# EAGLE design centerbody_logic (EAGLE 9.4.2)
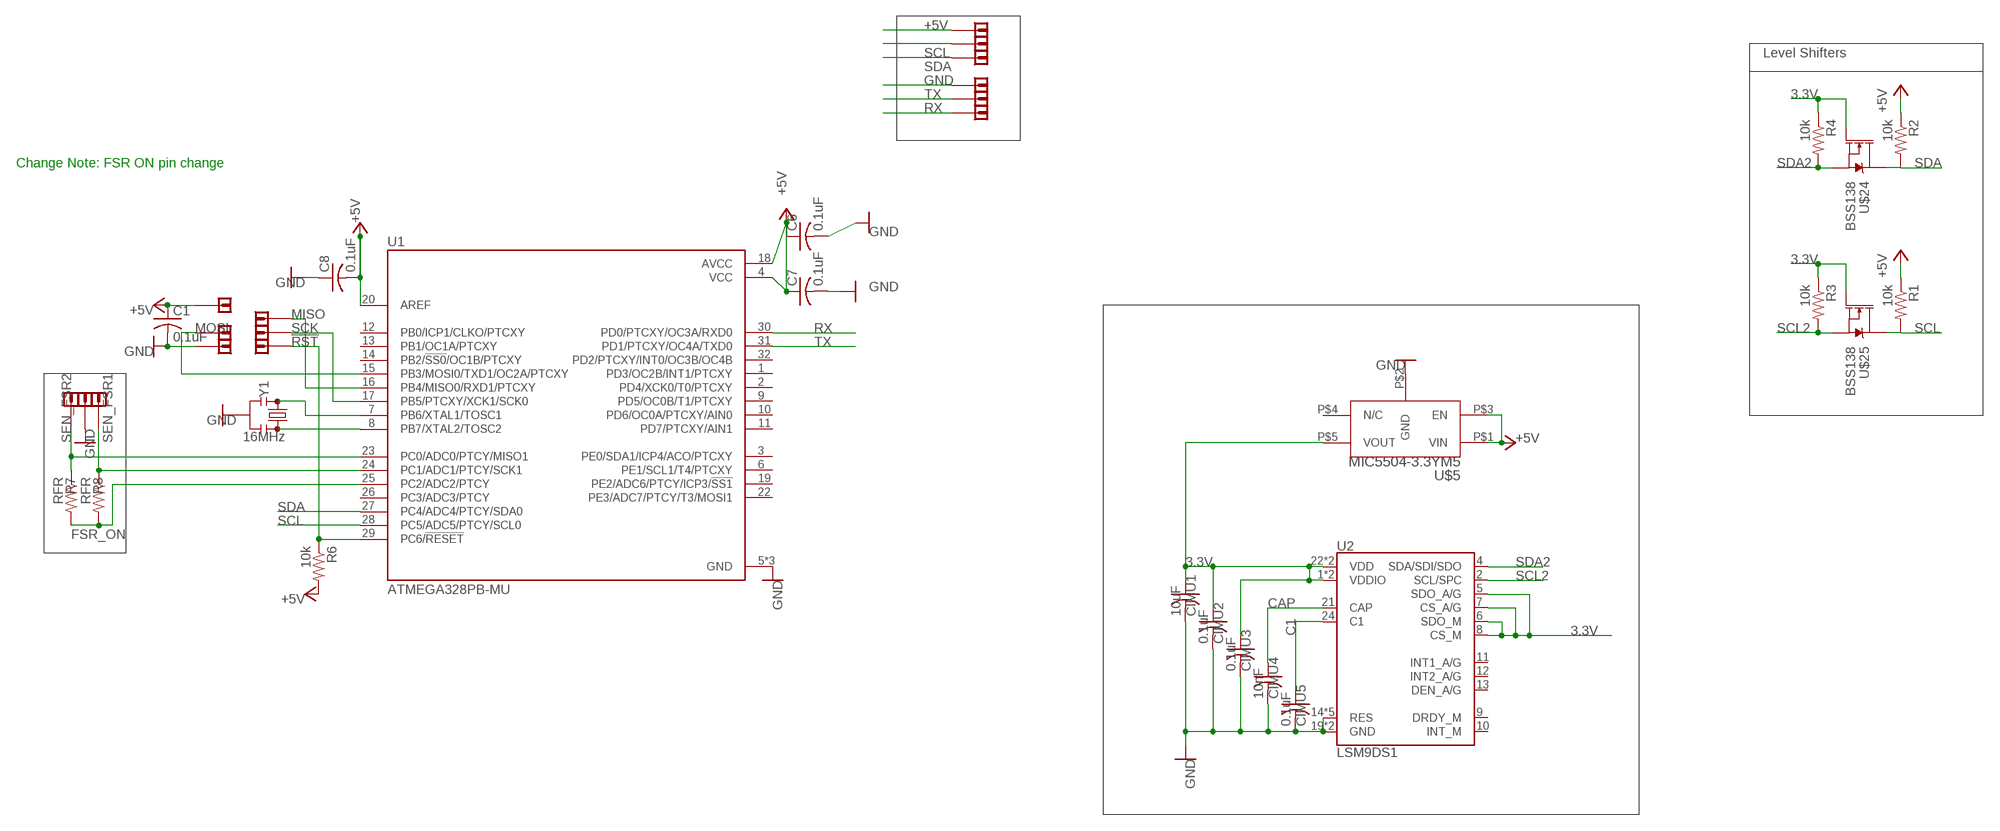
[diagram p0: schematic, sheet 1]

## Parts
C1  0.1uF  C-USC0402  [C0402]
C6  0.1uF  C-USC0402  [C0402]
C7  0.1uF  C-USC0402  [C0402]
C8  0.1uF  C-USC0402  [C0402]
CIMU1  10uF  C-USC0402  [C0402]
CIMU2  0.1uF  C-USC0402  [C0402]
CIMU3  0.1uF  C-USC0402  [C0402]
CIMU4  10nF  C-USC0402  [C0402]
CIMU5  0.1uF  C-USC0402  [C0402]
R1  10k  R-US_R0402  [R0402]
R2  10k  R-US_R0402  [R0402]
R3  10k  R-US_R0402  [R0402]
R4  10k  R-US_R0402  [R0402]
R6  10k  R-US_R0402  [R0402]
R7  RFR  R-US_R0402  [R0402]
R8  RFR  R-US_R0402  [R0402]
U1  ATMEGA328PB-MU  [QFN50P500X500X90-33N]
U2  LSM9DS1  [LGA24-8X4]
U$1  SIMPLE_VIA_CONNECTION  [SIMPLEVIA]
U$3  SIMPLE_VIA_CONNECTION  [SIMPLEVIA]
U$4  SIMPLE_VIA_CONNECTION  [SIMPLEVIA]
U$5  MIC5504-3.3YM5  [SOT23]
U$6  SIMPLE_VIA_CONNECTION  [SIMPLEVIA]
U$7  SIMPLE_VIA_CONNECTION  [SIMPLEVIA]
U$8  SIMPLE_VIA_CONNECTION  [SIMPLEVIA]
U$9  SIMPLE_VIA_CONNECTION  [SIMPLEVIA]
U$10  SIMPLE_VIA_CONNECTION  [SIMPLEVIA]
U$11  SIMPLE_VIA_CONNECTION  [SIMPLEVIA]
U$12  SIMPLE_VIA_CONNECTION  [SIMPLEVIA]
U$13  SIMPLE_VIA_CONNECTION  [SIMPLEVIA]
U$14  SIMPLE_VIA_CONNECTION  [SIMPLEVIA]
U$15  SIMPLE_VIA_CONNECTION  [SIMPLEVIA]
U$24  BSS138  [SOT-23]
U$25  BSS138  [SOT-23]
U$26  SIMPLE_VIA_CONNECTION  [SIMPLEVIA]
U$27  SIMPLE_VIA_CONNECTION  [SIMPLEVIA]
Y1  16MHz  RESONATOR-16MHZSMD_3.2X1.3  [RESONATOR-SMD-3.2X1.3]

## Nets
3.3V [power]: CIMU1.1 CIMU2.1 CIMU3.1 R3.1 R4.1 U2.1(VDDIO) U2.3(VDDIO) U2.5(SDO_A/G) U2.6(SDO_M) U2.7(CS_A/G) U2.8(CS_M) U2.22(VDD) U2.23(VDD) U$5.P$5(VOUT) U$24.P$1(G) U$25.P$1(G)
!RST [digital signals]: R6.1 U1.29(PC6/!RESET!) U$13.P$1
+5V [power]: C1.1 C6.1 C7.1 C8.2 R1.1 R2.1 R6.2 U1.4(VCC) U1.18(AVCC) U1.20(AREF) U$5.P$1(VIN) U$5.P$3(EN) U$7.P$1 U$10.P$1
C1 [analog signals]: CIMU5.1 U2.24(C1)
CAP [analog signals]: CIMU4.1 U2.21(CAP)
FSR_ON [digital signals]: R7.2 R8.2 U1.25(PC2/ADC2/PTCY)
GND [power]: C1.2 C6.2 C7.2 C8.1 CIMU1.2 CIMU2.2 CIMU3.2 CIMU4.2 CIMU5.2 U1.5(GND) U1.21(GND) U1.33(GND) U2.14(RES) U2.15(RES) U2.16(RES) U2.17(RES) U2.18(RES) U2.19(GND) U2.20(GND) U$3.P$1 U$5.P$2(GND) U$6.P$1 U$12.P$1 Y1.2
MISO [digital signals]: U1.16(PB4/MISO0/RXD1/PTCXY) U$15.P$1
MOSI [digital signals]: U1.15(PB3/MOSI0/TXD1/OC2A/PTCXY) U$11.P$1
N$1 [analog signals]: U1.8(PB7/XTAL2/TOSC2) Y1.3
N$2 [analog signals]: U1.7(PB6/XTAL1/TOSC1) Y1.1
RX [digital signals]: U1.30(PD0/PTCXY/OC3A/RXD0) U$27.P$1
SCK [digital signals]: U1.17(PB5/PTCXY/XCK1/SCK0) U$14.P$1
SCL [digital signals]: R1.2 U1.28(PC5/ADC5/PTCY/SCL0) U$9.P$1 U$25.P$3(D)
SCL2 [digital signals]: R3.2 U2.2(SCL/SPC) U$25.P$2(S)
SDA [digital signals]: R2.2 U1.27(PC4/ADC4/PTCY/SDA0) U$4.P$1 U$24.P$3(D)
SDA2 [digital signals]: R4.2 U2.4(SDA/SDI/SDO) U$24.P$2(S)
SEN_FSR1 [analog signals]: R8.1 U1.24(PC1/ADC1/PTCY/SCK1) U$8.P$1
SEN_FSR2 [analog signals]: R7.1 U1.23(PC0/ADC0/PTCY/MISO1) U$1.P$1
TX [digital signals]: U1.31(PD1/PTCXY/OC4A/TXD0) U$26.P$1
Unconnected: U1.1(PD3/OC2B/INT1/PTCXY) U1.2(PD4/XCK0/T0/PTCXY) U1.3(PE0/SDA1/ICP4/ACO/PTCXY) U1.6(PE1/SCL1/T4/PTCXY) U1.9(PD5/OC0B/T1/PTCXY) U1.10(PD6/OC0A/PTCXY/AIN0) U1.11(PD7/PTCXY/AIN1) U1.12(PB0/ICP1/CLKO/PTCXY) U1.13(PB1/OC1A/PTCXY) U1.14(PB2/!SS0!/OC1B/PTCXY) U1.19(PE2/ADC6/PTCY/ICP3/!SS1!) U1.22(PE3/ADC7/PTCY/T3/MOSI1) U1.26(PC3/ADC3/PTCY) U1.32(PD2/PTCXY/INT0/OC3B/OC4B) U2.9(DRDY_M) U2.10(INT_M) U2.11(INT1_A/G) U2.12(INT2_A/G) U2.13(DEN_A/G) U$5.P$4(N/C)

## Notes on the sheet
- Level Shifters
- Change Note: FSR ON pin change

## Library data of the parts
C1 C6-C8 CIMU2 CIMU3 CIMU5 = FA3D_lib:C-US: CAPACITOR, American symbol; PARTNO: 885012105010
CIMU1 = FA3D_lib:C-US: CAPACITOR, American symbol; PARTNO: GRM155R60G106ME44D
CIMU4 = FA3D_lib:C-US: CAPACITOR, American symbol; PARTNO: CL05B103KB5NNNC
R1-R4 R6 = FA3D_lib:R-US_: RESISTOR, American symbol; PARTNO: RR0510P-103-D
R7 R8 = FA3D_lib:R-US_: RESISTOR, American symbol; PARTNO: CRGCQ0402F5K6
U1 = FA3D_lib:ATMEGA328PB-MU: AVR 32KBytes Flash, 1KBytes EEPROM, 2KBytes RAM, w - 20MHZ, QFN/MFL, IND TEMP, GREEN 5 V/ DFN/QFN (M); DESCRIPTION: AVR 32KBytes Flash, 1KBytes EEPROM, 2KBytes RAM, w - 20MHZ, QFN/MFL, IND TEMP, GREEN 5 V/ DFN/QFN _M_; DIGI-KEY_PART_NUMBER: ATMEGA328PB-MU-ND; DIGI-KEY_PURCHASE_URL: https://www.digikey.com/product-detail/en/microchip-technology/ATMEGA328PB-MU/ATMEGA328PB-MU-ND/5638814?utm_source=snapeda&utm_medium=aggregator&utm_campaign=symbol; MF: Microchip; MP: ATMEGA328PB-MU; PACKAGE: VFQFN-32 Microchip; PARTNO: ATMEGA328PB-MUR
U2 = FA3D_lib:LSM9DS1: LSM9DS1 3D accelerometer, gyroscope & magnetometer The LSM9DS1 is a system-in-package featuring a 3D digital linear acceleration sensor, a 3D digital angular rate sensor, and a 3D digital magnetic sensor. The LSM9DS1 has a linear acceleration full scale of ±2g/±4g/±8/±16 g, a magnetic field full scale of ±4/±8/±12/±16 gauss and an angular rate of ±245/±500/±2000 dps. The LSM9DS1 includes an I2 C serial bus interface supporting standard and fast mode (100 kHz and 400 kHz) and an SPI serial standard interface. Magnetic, accelerometer and gyroscope sensing can be enabled or set in power-down mode separately for smart power management. The LSM9DS1 is available in a plastic land grid array package (LGA) and it is guaranteed to operate over an extended temperature range from -40 °C to +85 °C.; PARTNO: LSM9DS1TR; PROD_ID: IC-12536
U$1 U$3 U$4 U$6-U$15 U$26 U$27 = FA3D_lib:SIMPLE_VIA_CONNECTION
U$5 = FA3D_lib:MIC5504-3.3YM5; PARTNO: MIC5504-3.3YM5-TR
U$24 U$25 = FA3D_lib:BSS138; PARTNO: BSS138
Y1 = SparkFun-Clocks:RESONATOR-16MHZ: 16MHz Resonator Digikey Example <http://www.digikey.com/product-detail/en/murata-electronics-north-america/CSTCE16M0V53-R0/490-1198-1-ND/584635> Frequency: 16MHz Frequency Stability: ±0.3% Frequency Tolerance: ±0.5% Capacitance: 15pF SparkFun Products SparkFun OpenLog <https://www.sparkfun.com/products/13712> SparkFun MicroView - OLED Arduino Module <https://www.sparkfun.com/products/12923>; PARTNO: CSTNE16M0V530000R0; PROD_ID: XTAL-08900

## Net classes
1 digital signals: width 0.15 mm, drill 0.3 mm, clearance 0.01 mm
2 analog signals: width 0.2 mm, drill 0.3 mm, clearance 0.015 mm
3 power: width 0.2 mm, drill 0.3 mm, clearance 0.015 mm

## Board
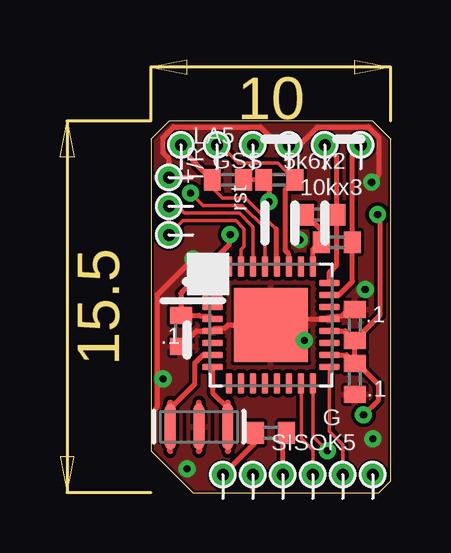
[diagram p1: board, top side]
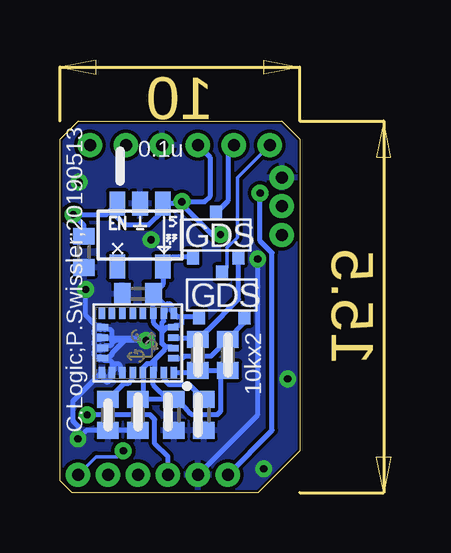
[diagram p2: board, bottom side, seen from below]

Size 10 x 15.5 mm. Coordinates in mm from the lower left corner, seen from the top.
Outline: 1.75,0 9.5,0 10,0.5 10,14.75 9.25,15.5 0.75,15.5 0,14.75 0,1.75 1.75,0
Copper layers (1*16): Top 0.035mm / dielectric 1.5mm / Bottom 0.035mm
Design rules "Swissler_Aggressive": minimum track width 0.1mm, minimum drill 0.3mm, track to track 0.15mm, track to pad 0.15mm, pad to pad 0.15mm, via to via 0.15mm, smd to smd 0.1mm, copper to edge 0.1mm, drill to drill 0.1mm, minimum pad ring 10mil, minimum via ring 8mil, stop-mask expansion 4mil, vias tented up to drill 25mil, thermal gap 0.125mm

### Footprints (pad centres in the part's own frame; a part is rotated, then mirrored left to right if it is on the bottom)
C0402 = smd 0.7 x 0.9: 1 -0.65,0; 2 0.65,0
R0402 = smd 0.7 x 0.9: 1 -0.65,0; 2 0.65,0
QFN50P500X500X90-33N = smd 0.86 x 0.26: 1 -2.435,1.75; 2 -2.435,1.25; 3 -2.435,0.75; 4 -2.435,0.25; 5 -2.435,-0.25; 6 -2.435,-0.75; 7 -2.435,-1.25; 8 -2.435,-1.75; 17 2.435,-1.75; 18 2.435,-1.25; 19 2.435,-0.75; 20 2.435,-0.25; 21 2.435,0.25; 22 2.435,0.75; 23 2.435,1.25; 24 2.435,1.75 | smd 0.26 x 0.86: 9 -1.75,-2.435; 10 -1.25,-2.435; 11 -0.75,-2.435; 12 -0.25,-2.435; 13 0.25,-2.435; 14 0.75,-2.435; 15 1.25,-2.435; 16 1.75,-2.435; 25 1.75,2.435; 26 1.25,2.435; 27 0.75,2.435; 28 0.25,2.435; 29 -0.25,2.435; 30 -0.75,2.435; 31 -1.25,2.435; 32 -1.75,2.435 | smd 3.1 x 3.1: 33 0,0
LGA24-8X4 = smd 0.27 x 0.45: 1 -1.505,1.225; 6 -1.505,-1.225; 7 -1.075,-1.225; 8 -0.645,-1.225; 9 -0.215,-1.225; 10 0.215,-1.225; 11 0.645,-1.225; 12 1.075,-1.225; 13 1.505,-1.225; 18 1.505,1.225; 19 1.075,1.225; 20 0.645,1.225; 21 0.215,1.225; 22 -0.215,1.225; 23 -0.645,1.225; 24 -1.075,1.225 | smd 0.45 x 0.27: 2 -1.475,0.645; 3 -1.475,0.215; 4 -1.475,-0.215; 5 -1.475,-0.645; 14 1.475,-0.645; 15 1.475,-0.215; 16 1.475,0.215; 17 1.475,0.645
SIMPLEVIA = drill 0.5: P$1 0,0
SOT23 = smd 0.66 x 1: P$1 0.95,1.315; P$2 0,1.315; P$3 -0.95,1.315; P$4 -0.95,-1.315; P$5 0.95,-1.315
SOT-23 = smd 0.5 x 0.6: P$1 -0.95,-0.925; P$2 0.95,-0.925; P$3 0,0.925
RESONATOR-SMD-3.2X1.3 = smd 0.45 x 1.905: 1 -1.2,0; 2 0,0; 3 1.2,0

### Placement (x,y rotation side)
C1  1.25,6.75 270 top
C6  8.5,4.75 270 top
C7  8.5,7 90 top
C8  9,10.05 90 bottom
CIMU1  5.25,3.25 270 bottom
CIMU2  6.75,3.25 270 bottom
CIMU3  6.75,8.3 180 bottom
CIMU4  8,3.25 270 bottom
CIMU5  4,3.25 270 bottom
R1  3.2,13.05 180 top
R2  5.35,13.05 0 top
R3  3,5.75 90 bottom
R4  4.25,5.75 90 bottom
R6  5,2.5 0 top
R7  7.75,10.45 180 top
R8  7.1,11.6 180 top
U1  5,7 0 top
U2  6.75,6.25 180 bottom
U$1  8.75,14.5 0 top
U$3  0.75,13.15 90 top
U$4  2.75,14.5 0 top
U$5  6.66,10.75 0 bottom
U$6  5.75,14.5 0 top
U$7  4.25,14.5 0 top
U$8  7.25,14.5 0 top
U$9  1.25,14.5 0 top
U$10  5.5,0.75 0 top
U$11  6.75,0.75 0 top
U$12  4.25,0.75 0 top
U$13  3,0.75 0 top
U$14  8,0.75 0 top
U$15  9.25,0.75 0 top
U$24  3.5,10.75 0 bottom
U$25  3.25,8.25 0 bottom
U$26  0.75,10.75 90 top
U$27  0.75,11.95 90 top
Y1  2,2.75 0 top

### Tracks (layer width: path | path; a pad name or v marks a point on that pad's centre or on a via)
3.3V
  Bottom 0.2: CIMU1.1 5.5,3.9 6.11,4.5 U2.23 6.06,5.07 6.06,5.53 | U2.1 4.33,5.03 R4.1 R3.1 3.3,4.8 3.3,3.4 3.45,3.25 4.5,3.25 4.55,3.3 4.7,3.45 5.15,3.9 CIMU1.1 | CIMU3.1 5.71,8.69 U$5.P$5 5.32,9.82 U$24.P$1 | U2.7 5.58,7.57 5.58,7.8 5.51,7.88 5.41,7.88 5.33,7.8 5.33,7.57 U2.6 5.09,7.33 4.84,7.33 | U2.7 5.67,7.88 CIMU3.1 | CIMU3.1 U2.8 6.11,7.11 5.75,6.75 | U$25.P$1 4.84,7.33 | 4.84,7.33 4.92,7.25 4.92,7.06 5,6.99 5.18,6.99 U2.5 5.56,6.89 5.75,6.7 | U2.3 5.32,6.08 5.6,6.08 5.64,6.11 | 5.64,6.11 5.75,6.23 5.75,6.7 | U2.7 5.67,7.16 5.75,7.09 5.75,6.75 | 5.75,6.7 5.75,6.75 | 5.64,6.11 5.64,5.96 6.06,5.53 | 6.06,5.53 6.22,5.38 6.37,5.38 6.54,5.21 U2.22 6.54,4.12 CIMU2.1 CIMU1.1
!RST  (via drill 0.3)
  Top 0.152: U1.29 4.75,11.03 3.8,11.98 2.17,11.98 v1.65,12.5
  Top 0.2: U$13.P$1 4.35,2.1 R6.1
  Bottom 0.2: v1.65,12.5 1.65,10.5 1.15,10 1.15,2.6 U$13.P$1
+5V  (via drill 0.3)
  Top 0.2: U$10.P$1 5.5,2.35 R6.2 | U1.4 2.44,7.37 2.05,7.37 2.02,7.4 C1.1 1.25,8.33 3.25,10.33 3.25,10.72 v3.3,10.77 | U1.20 8.1,6.75 C7.1 | U1.18 8.15,5.75 C6.1 | v8.87,3.25 9.5,3.88 9.5,4.5 8.6,5.4 C6.1 | C6.1 C7.1 | C7.1 9.55,7.4 9.55,11.5 v9.45,11.6 | R1.1 R2.1 4.91,12.84 v4.91,12.14
  Bottom 0.2: U$10.P$1 5.5,1.5 6.05,2.05 6.05,3.05 6.2,3.2 6.25,3.25 v8.86,3.25 v8.87,3.25 | v3.3,10.77 3.65,10.77 4.91,12.03 v4.91,12.14 | U$7.P$1 3.74,13.99 3.74,12.35 3.96,12.14 v4.91,12.14 | C8.2 9,11.15 v9.45,11.6 8.07,11.6 U$5.P$3 7.89,11.78 7.28,11.16 6.32,11.16 5.71,11.77 U$5.P$1 4.91,12.06 v4.91,12.14
C1
  Bottom 0.2: CIMU5.1 4.6,4.5 5.43,4.5 5.63,4.7 5.63,4.98 U2.24
CAP
  Bottom 0.2: U2.21 7.01,4.98 7.01,4.7 7.16,4.55 7.35,4.55 CIMU4.1
FSR_ON
  Top 0.2: 7.1,10.5 R7.2 | U1.25 6.75,10.15 7.1,10.5 | R8.2 7.1,10.95 7.1,10.5
GND  (via drill 0.3)
  Top 0.2: C7.2 8.23,7.65 7.95,7.37 7.55,7.37 U1.21 5.25,7.25 U1.33 3.21,7 3.08,6.87 2.69,6.87 U1.5 1.9,6.75 C1.2 | v1.75,9.75 0.25,8.25 0.25,3.55 0.2,3.5 | 1.65,13.15 U$3.P$1 0.75,13.93 0.5,14.19 0.5,14.81 0.94,15.25 4.56,15.25 5.32,14.5 U$6.P$1 6.18,14.5 6.94,15.25 9.06,15.25 9.5,14.81 9.5,14.19 9.5,14.18 9.5,13.25 v9.2,12.95
  Bottom 0.2: U2.20 7.49,5.12 7.49,5.3 7.56,5.38 7.66,5.38 7.74,5.3 7.74,5.12 7.8,5.05 | 7.8,5.05 U2.19 7.92,4.93 7.92,4.7 7.99,4.62 8.09,4.62 8.16,4.7 8.16,4.93 U2.18 9.47,3.81 9.47,3 9.25,2.78 v9.25,2.25 8.9,2.6 CIMU4.2 CIMU2.2 | 8.13,5.51 7.9,5.51 7.83,5.44 7.83,5.08 7.8,5.05 | 8.13,5.51 U2.17 8.31,5.7 8.5,5.7 8.57,5.77 8.57,5.87 8.5,5.95 8.31,5.95 U2.16 | U2.16 8.31,6.12 8.5,6.12 8.57,6.2 8.57,6.3 8.5,6.38 8.31,6.38 U2.15 | U2.14 8.31,6.8 8.5,6.8 8.57,6.73 8.57,6.63 8.5,6.55 8.31,6.55 U2.15 | U2.14 8.31,6.99 8.5,6.99 8.93,7.42 v8.93,8.47 | U$12.P$1 1.75,3.25 v1.75,9.75 | v6.4,6.35 6.51,6.46 8.04,6.46 U2.15 | v6.4,6.35 7.68,6.35 7.83,6.5 7.83,6.73 7.9,6.8 8.13,6.8 U2.14 | v6.4,6.35 7.86,6.35 7.86,6.34 7.83,6.3 7.83,6.2 7.9,6.12 8.13,6.12 U2.16 | v6.4,6.35 7.3,6.35 7.83,5.83 7.83,5.77 7.9,5.7 7.96,5.7 8.13,5.51
  other vias: 1.5,1 6.2,10.55 0.5,4.75
  pour Top: -0.5,16 -0.5,-0.5 10.5,-0.5 10.5,16
  pour Bottom (rank 6): -0.5,16 -0.5,-0.5 10.5,-0.5 10.5,16
MISO  (via drill 0.3)
  Top 0.152: U1.16 6.75,2.36 v7.36,1.75
  Bottom 0.152: v7.36,1.75 7.61,1.5 8.5,1.5 U$15.P$1
MOSI
  Top 0.152: U$11.P$1 6.75,1.79 6.28,2.26 6.28,4.54 U1.15
N$1
  Top 0.2: U1.8 2.56,4.17 3.2,3.54 Y1.3
N$2
  Top 0.2: U1.7 2.17,5.75 1.83,5.42 1.83,4.54 0.8,3.5 Y1.1
RX
  Top 0.152: U$27.P$1 1.11,11.95 1.4,11.66 3.68,11.66 4.25,11.09 U1.30
SCK
  Top 0.152: U1.17 7.43,2.56 8,2 U$14.P$1
SCL
  Top 0.15: R1.2 2.55,12.73 2.99,12.29 3.93,12.29 5.22,11
  Top 0.2: 5.22,11 5.22,9.47 U1.28 | R1.2 1.25,14.35 U$9.P$1
  Bottom 0.152: U$25.P$3 3.03,9.4 3.03,10.22 2.6,10.64 2.6,13.15 U$9.P$1
SCL2
  Bottom 0.2: U2.2 4.9,5.61 4.8,5.7 3.7,5.7 R3.2 2.3,7.1 U$25.P$2
SDA
  Top 0.15: R2.2 5.3,13.75 3.65,13.75 2.9,14.5
  Top 0.2: U1.27 5.75,9.95 5.6,10.1 5.6,12.65 R2.2 | 2.9,14.5 U$4.P$1
  Bottom 0.2: U$4.P$1 3,14.25 3,12.18 U$24.P$3
SDA2
  Bottom 0.2: U2.4 4.32,6.46 R4.2 3.88,6.78 3.85,6.78 2.55,8.07 U$24.P$2
SEN_FSR1
  Top 0.2: U1.24 7.43,9.19 7.75,9.5 R8.1 7.75,14 U$8.P$1
SEN_FSR2
  Top 0.2: U1.23 7.83,8.25 8.4,8.82 R7.1 8.4,14.15 U$1.P$1
TX
  Top 0.152: U$26.P$1 1.34,11.35 3.54,11.35 3.88,11.01 3.88,10.28 3.75,10.14 U1.31

### Text on the board
tPlace: LA5 / GSS | 5k6x2 | T/R | rst | 10kx3 | .1 | .1 | .1 | G / SISOK5
bPlace: C.Logic;P.Swissler;20190513 | 0.1u | 10kx2